# EAGLE design 06_ALU_IN (EAGLE 7.5.0)
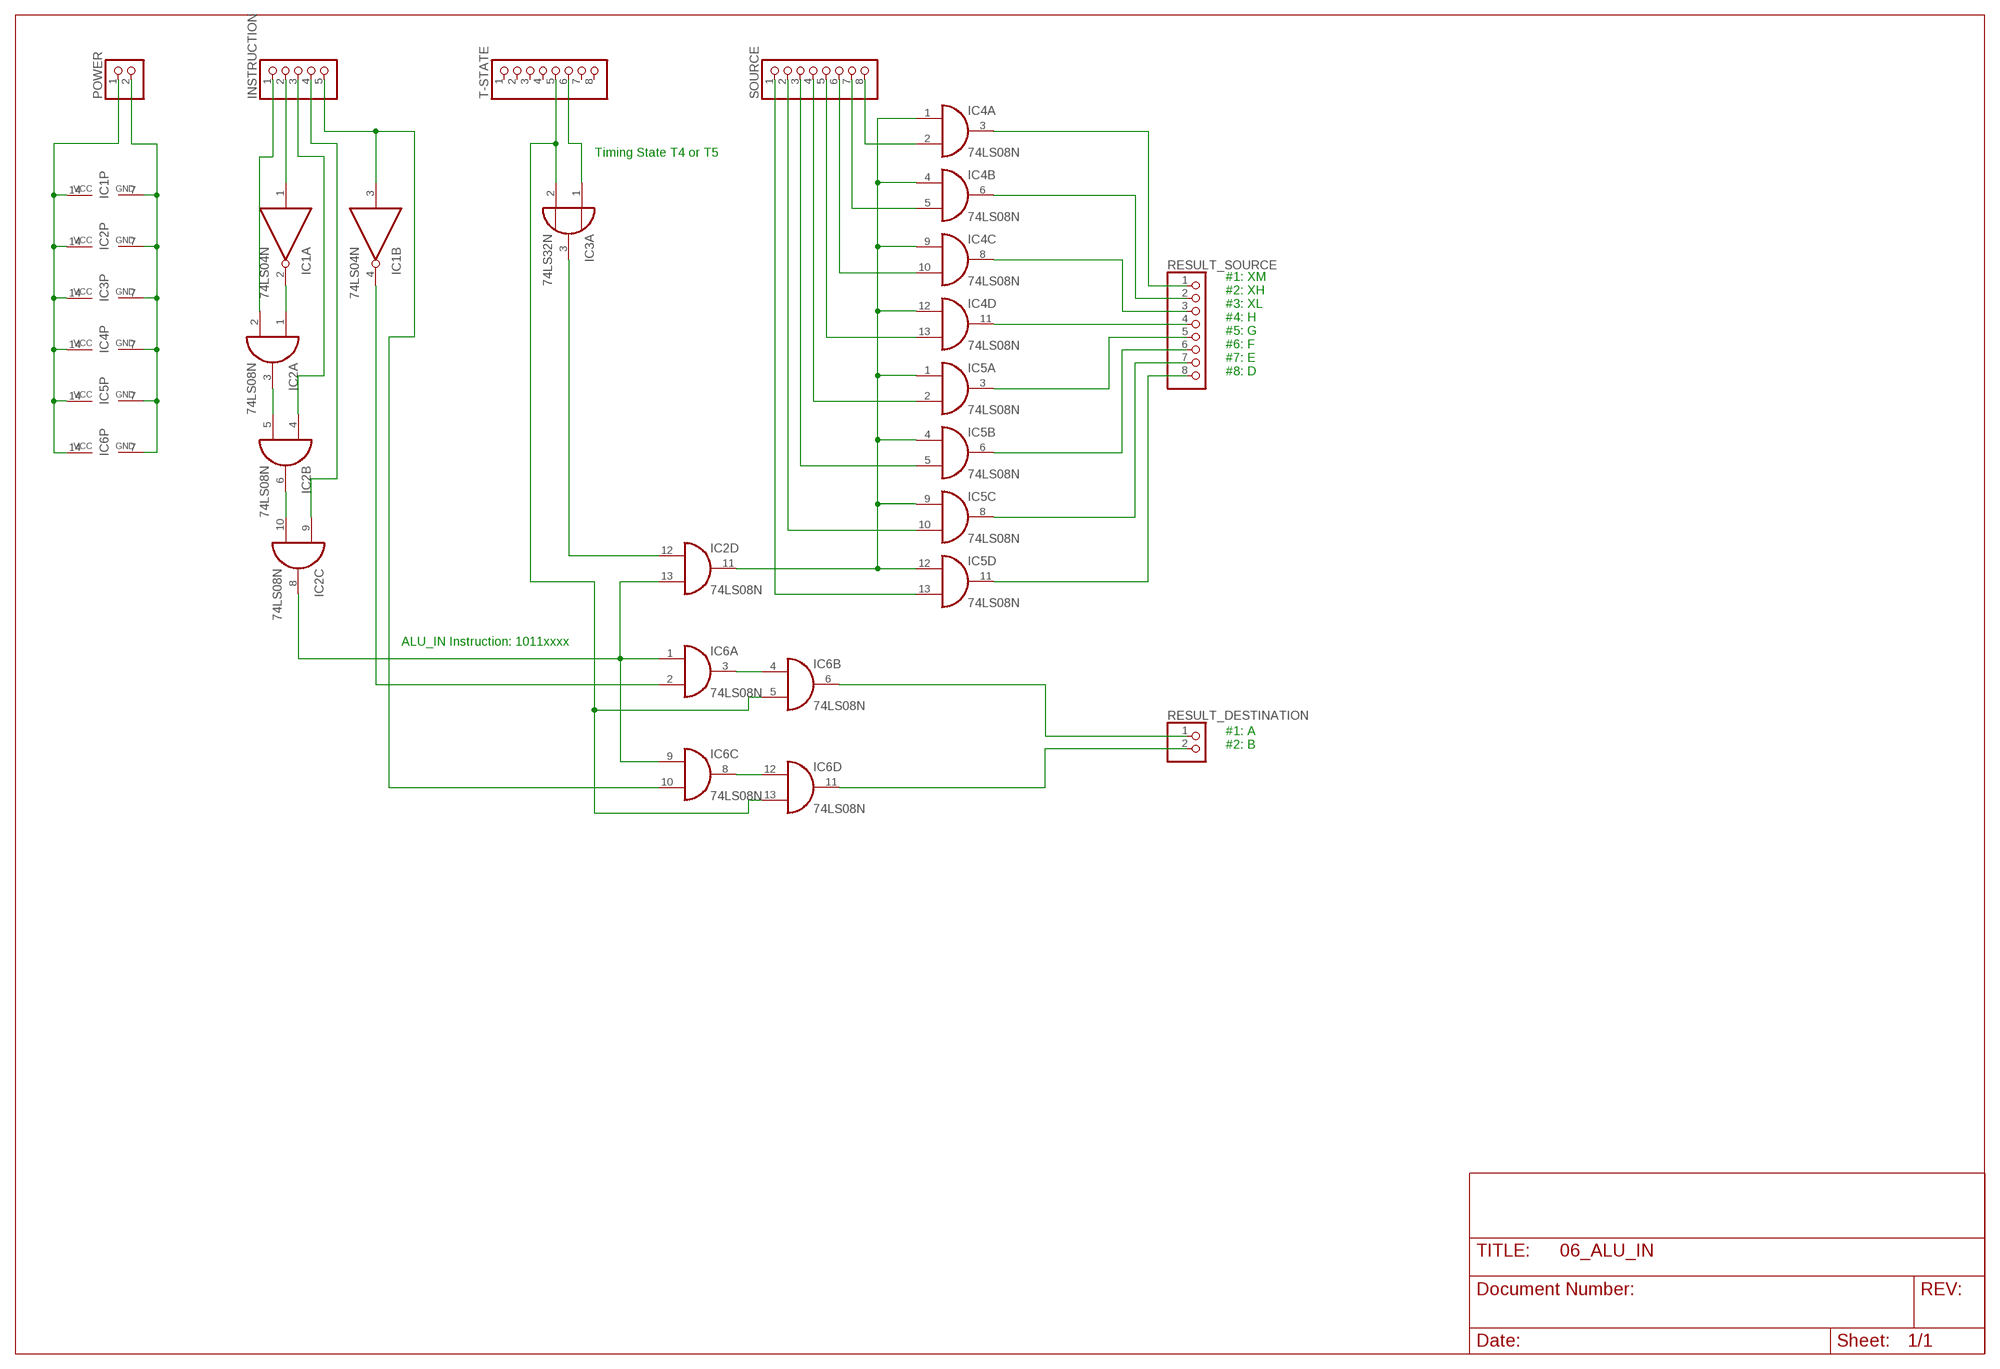
[diagram p0: schematic, sheet 1]

## Parts
IC1  74LS04N  [DIL14]
IC2  74LS08N  [DIL14]
IC3  74LS32N  [DIL14]
IC4  74LS08N  [DIL14]
IC5  74LS08N  [DIL14]
IC6  74LS08N  [DIL14]
INSTRUCTION  PINHD-1X5  [1X05]
POWER  PINHD-1X2  [1X02]
RESULT_DESTINATION  PINHD-1X2  [1X02]
RESULT_SOURCE  PINHD-1X8  [1X08]
SOURCE  PINHD-1X8  [1X08]
T-STATE  PINHD-1X8  [1X08]

## Nets
GND: IC1.7(P:GND) IC2.7(P:GND) IC3.7(P:GND) IC4.7(P:GND) IC5.7(P:GND) IC6.7(P:GND) POWER.2
N$1: IC1.1(A:I) INSTRUCTION.2
N$2: IC2.2(A:I1) INSTRUCTION.1
N$3: IC4.3(A:O) RESULT_SOURCE.1
N$4: IC1.2(A:O) IC2.1(A:I0)
N$5: IC2.3(A:O) IC2.5(B:I1)
N$6: IC2.4(B:I0) INSTRUCTION.3
N$7: IC2.6(B:O) IC2.10(C:I1)
N$8: IC2.9(C:I0) INSTRUCTION.4
N$9: IC2.8(C:O) IC2.13(D:I1) IC6.1(A:I0) IC6.9(C:I0)
N$10: IC3.2(A:I1) IC6.5(B:I1) IC6.13(D:I1) T-STATE.5
N$11: IC3.1(A:I0) T-STATE.6
N$12: IC2.12(D:I0) IC3.3(A:O)
N$13: IC2.11(D:O) IC4.1(A:I0) IC4.4(B:I0) IC4.9(C:I0) IC4.12(D:I0) IC5.1(A:I0) IC5.4(B:I0) IC5.9(C:I0) IC5.12(D:I0)
N$14: IC5.13(D:I1) SOURCE.1
N$15: IC5.10(C:I1) SOURCE.2
N$16: IC5.5(B:I1) SOURCE.3
N$17: IC5.2(A:I1) SOURCE.4
N$18: IC4.13(D:I1) SOURCE.5
N$19: IC4.10(C:I1) SOURCE.6
N$20: IC4.5(B:I1) SOURCE.7
N$21: IC4.2(A:I1) SOURCE.8
N$22: IC4.6(B:O) RESULT_SOURCE.2
N$23: IC4.8(C:O) RESULT_SOURCE.3
N$24: IC4.11(D:O) RESULT_SOURCE.4
N$25: IC5.3(A:O) RESULT_SOURCE.5
N$26: IC5.6(B:O) RESULT_SOURCE.6
N$27: IC5.8(C:O) RESULT_SOURCE.7
N$28: IC5.11(D:O) RESULT_SOURCE.8
N$29: IC1.3(B:I) IC6.10(C:I1) INSTRUCTION.5
N$30: IC1.4(B:O) IC6.2(A:I1)
N$31: IC6.3(A:O) IC6.4(B:I0)
N$32: IC6.8(C:O) IC6.12(D:I0)
N$33: IC6.6(B:O) RESULT_DESTINATION.1
N$34: IC6.11(D:O) RESULT_DESTINATION.2
VCC: IC1.14(P:VCC) IC2.14(P:VCC) IC3.14(P:VCC) IC4.14(P:VCC) IC5.14(P:VCC) IC6.14(P:VCC) POWER.1
Unconnected: IC1.5(C:I) IC1.6(C:O) IC1.8(D:O) IC1.9(D:I) IC1.10(E:O) IC1.11(E:I) IC1.12(F:O) IC1.13(F:I) IC3.4(B:I0) IC3.5(B:I1) IC3.6(B:O) IC3.8(C:O) IC3.9(C:I0) IC3.10(C:I1) IC3.11(D:O) IC3.12(D:I0) IC3.13(D:I1) T-STATE.1 T-STATE.2 T-STATE.3 T-STATE.4 T-STATE.7 T-STATE.8

## Notes on the sheet
- Timing State T4 or T5
- #1: XM
  #2: XH
  #3: XL
  #4: H
  #5: G
  #6: F
  #7: E
  #8: D
- ALU_IN Instruction: 1011xxxx
- #1: A
  #2: B

## Library data of the parts
IC1 = 74xx-eu:74*04: Hex INVERTER
IC2 IC4-IC6 = 74xx-eu:74*08: Quad 2-input AND gate
IC3 = 74xx-eu:74*32: Quad 2-input OR gate
INSTRUCTION = pinhead:PINHD-1X5: PIN HEADER
POWER RESULT_DESTINATION = pinhead:PINHD-1X2: PIN HEADER
RESULT_SOURCE SOURCE T-STATE = pinhead:PINHD-1X8: PIN HEADER

## Board
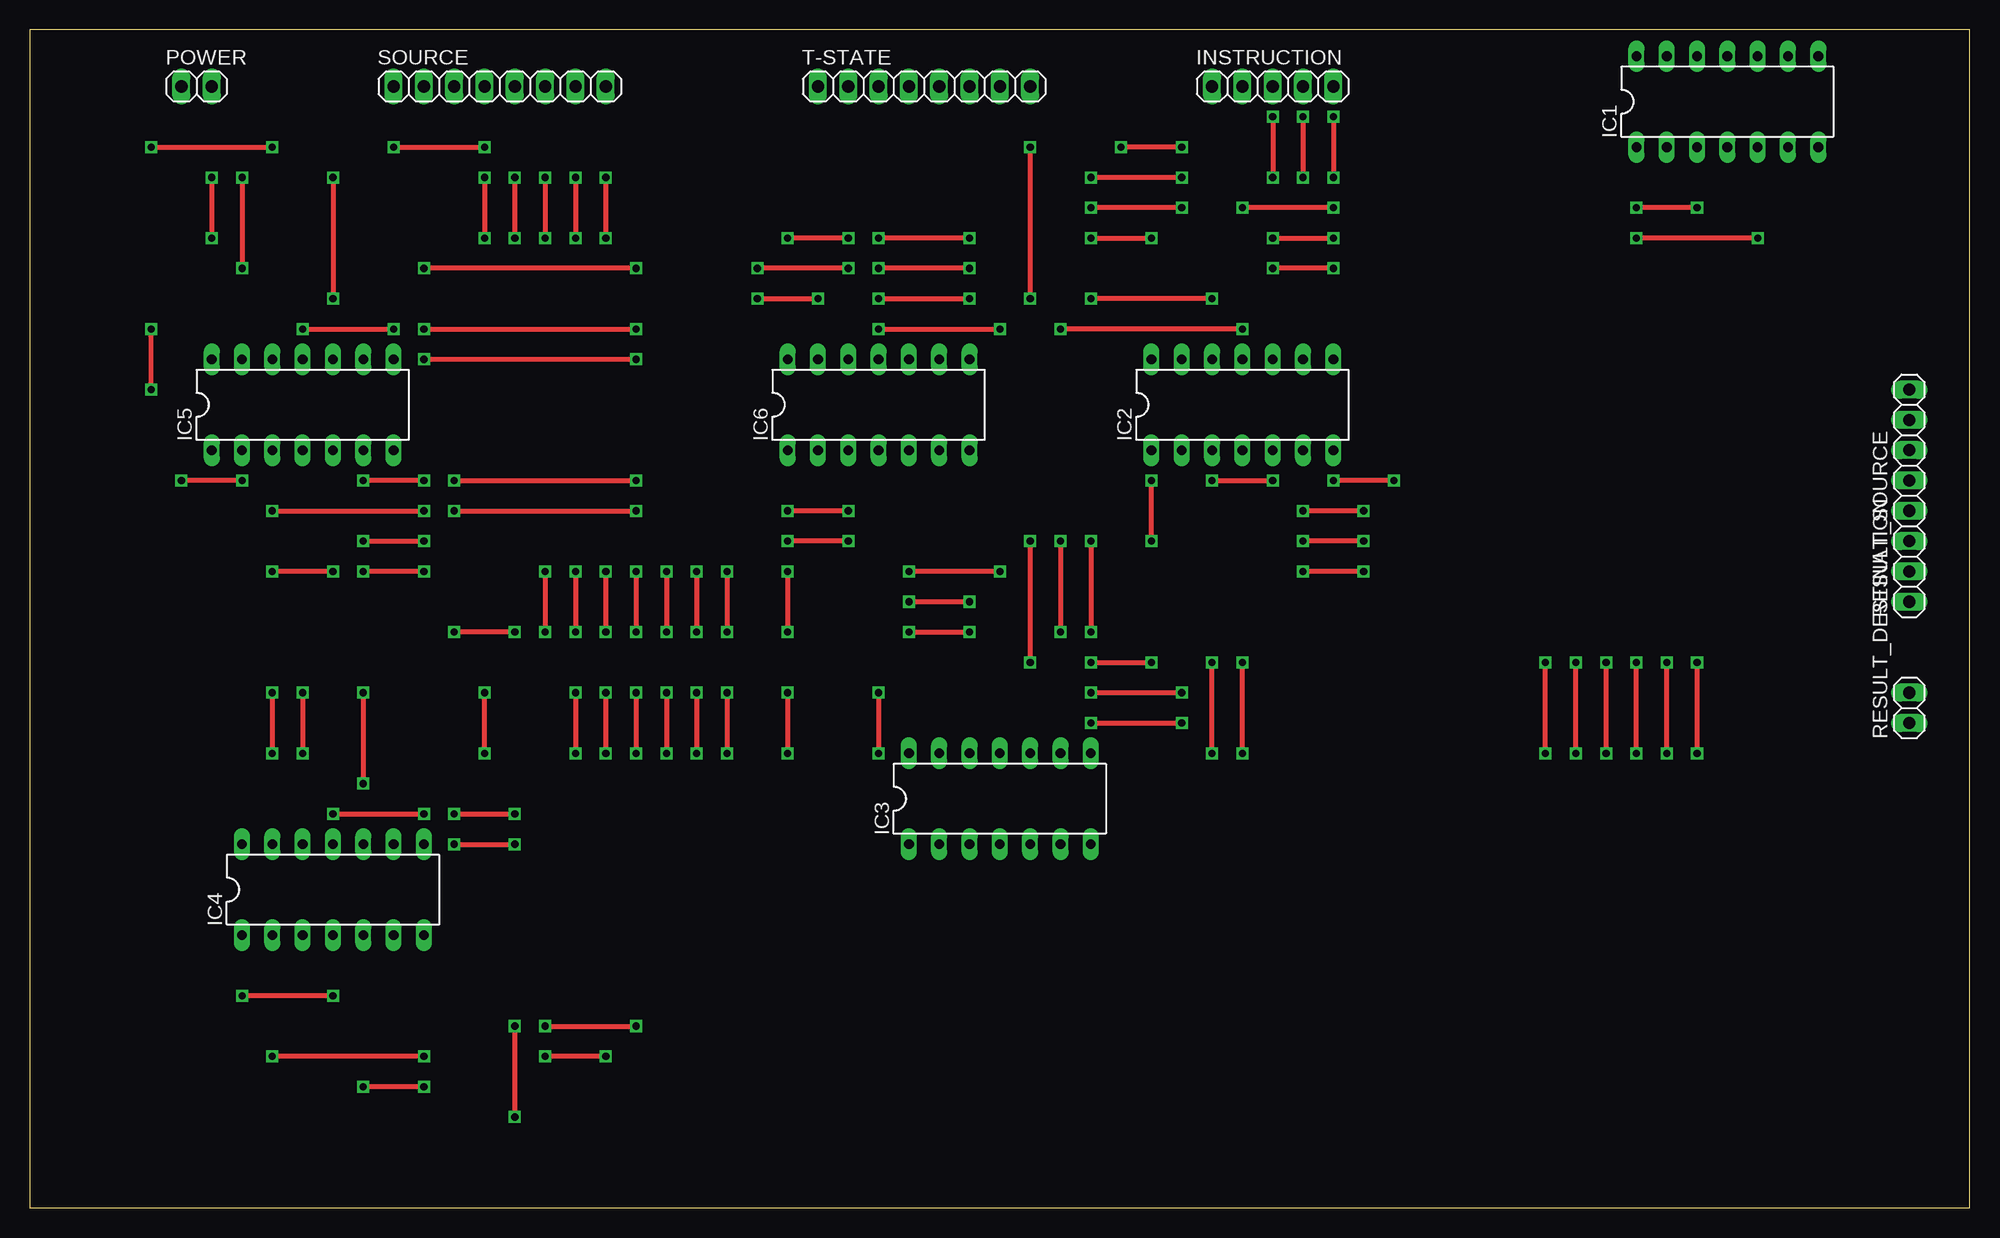
[diagram p1: board, top side]
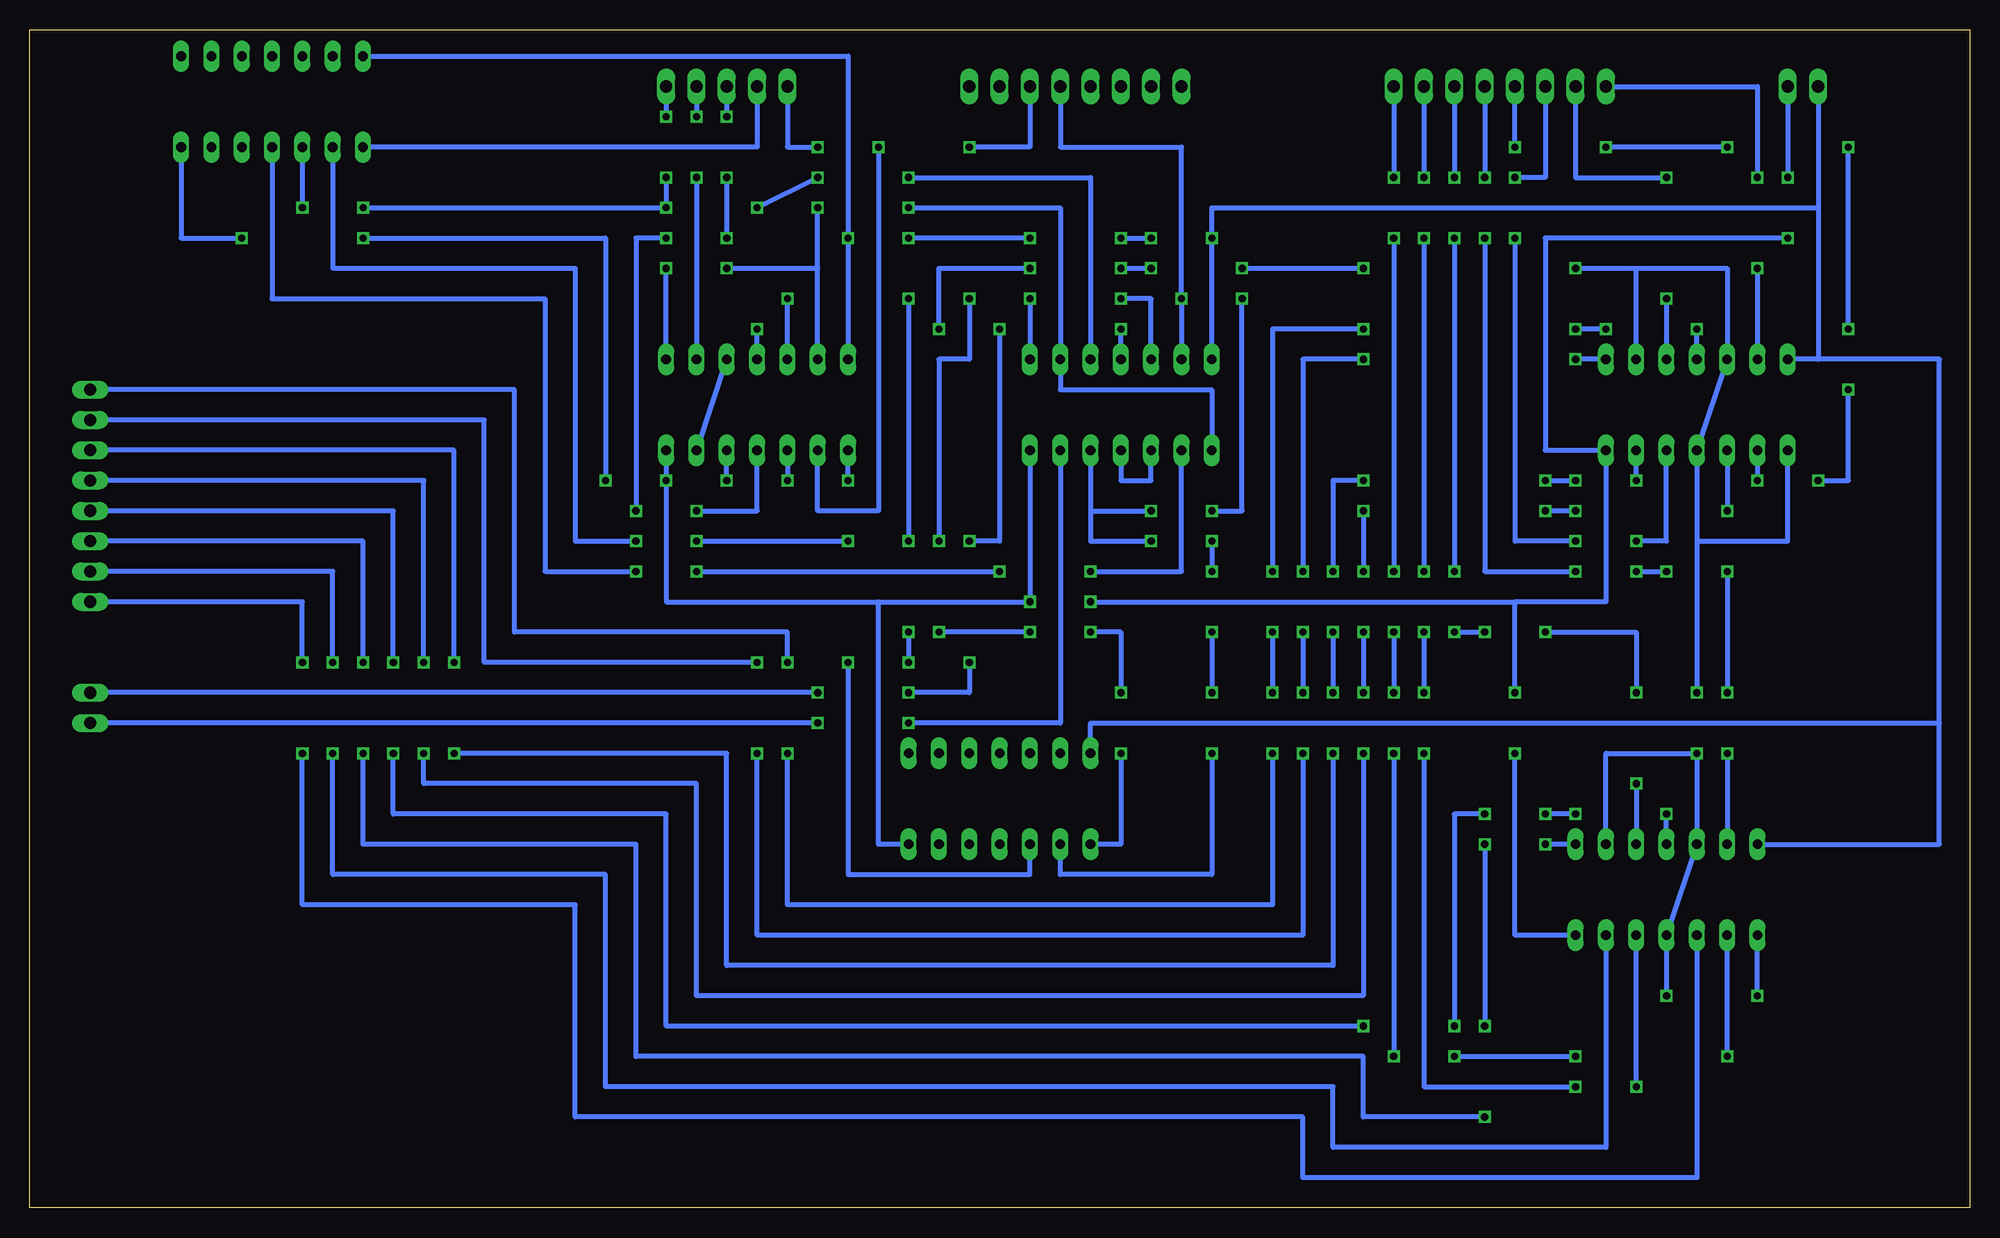
[diagram p2: board, bottom side, seen from below]

Size 162.54 x 98.73 mm. Coordinates in mm from the lower left corner, seen from the top.
Outline: 0,0 162.54,0 162.54,98.73 0,98.73 0,0
Copper layers (1*16): Top 0.035mm / dielectric 1.5mm / Bottom 0.035mm
Design rules "default": minimum track width 10mil, minimum drill 24mil, track to track 8mil, track to pad 8mil, pad to pad 8mil, via to via 8mil, smd to smd 8mil, copper to edge 40mil, drill to drill 8mil, minimum pad ring 10mil, minimum via ring 8mil, stop-mask expansion 4mil, vias tented up to drill 0mil, thermal gap 10mil

### Footprints (pad centres in the part's own frame; a part is rotated, then mirrored left to right if it is on the bottom)
DIL14 = drill 0.813 long: 1 -7.62,-3.81; 2 -5.08,-3.81; 3 -2.54,-3.81; 4 0,-3.81; 5 2.54,-3.81; 6 5.08,-3.81; 7 7.62,-3.81; 8 7.62,3.81; 9 5.08,3.81; 10 2.54,3.81; 11 0,3.81; 12 -2.54,3.81; 13 -5.08,3.81; 14 -7.62,3.81
1X05 = drill 1.016 long: 1 -5.08,0; 2 -2.54,0; 3 0,0; 4 2.54,0; 5 5.08,0
1X02 = drill 1.016 long: 1 -1.27,0; 2 1.27,0
1X08 = drill 1.016 long: 1 -8.89,0; 2 -6.35,0; 3 -3.81,0; 4 -1.27,0; 5 1.27,0; 6 3.81,0; 7 6.35,0; 8 8.89,0

### Placement (x,y rotation side)
IC1  142.24,92.71 0 top
IC2  101.6,67.31 0 top
IC3  81.28,34.29 0 top
IC4  25.4,26.67 0 top
IC5  22.86,67.31 0 top
IC6  71.12,67.31 0 top
INSTRUCTION  104.14,93.98 0 top
POWER  13.97,93.98 0 top
RESULT_DESTINATION  157.48,41.91 90 top
RESULT_SOURCE  157.48,59.69 90 top
SOURCE  39.37,93.98 0 top
T-STATE  74.93,93.98 0 top

### Tracks (layer width: path | path; a pad name or v marks a point on that pad's centre or on a via)
GND  (via drill 0.6)
  Top 0.406: v15.24,86.36 v15.24,81.28 | v38.1,38.1 v38.1,43.18 | v114.3,60.96 v109.22,60.96 | v78.74,50.8 v73.66,50.8 | v144.78,81.28 v134.62,81.28
  Bottom 0.406: POWER.2 v15.24,86.36 | v15.24,81.28 35.56,81.28 35.56,63.5 IC5.7 30.48,50.8 38.1,50.8 | IC2.7 v109.22,60.96 109.22,50.8 91.44,50.8 | 91.44,50.8 v78.74,50.8 IC6.7 | IC3.7 91.44,30.48 91.44,50.8 | IC4.7 38.1,22.86 v38.1,38.1 | v38.1,43.18 38.1,50.8 | v73.66,50.8 38.1,50.8 | IC1.7 149.86,81.28 v144.78,81.28 | v134.62,81.28 114.3,81.28 v114.3,60.96
N$1
  Bottom 0.406: INSTRUCTION.2 101.6,88.9 IC1.1
N$2  (via drill 0.6)
  Top 0.406: v96.52,88.9 v91.44,88.9
  Bottom 0.406: INSTRUCTION.1 99.06,88.9 v96.52,88.9 | v91.44,88.9 91.44,58.42 96.52,58.42 IC2.2
N$3  (via drill 0.6)
  Top 0.406: v139.7,38.1 v139.7,45.72
  Bottom 0.406: IC4.3 22.86,2.54 55.88,2.54 55.88,7.62 116.84,7.62 116.84,25.4 139.7,25.4 v139.7,38.1 | v139.7,45.72 139.7,50.8 RESULT_SOURCE.1
N$4  (via drill 0.6)
  Top 0.406: v111.76,55.88 v106.68,55.88 | v93.98,55.88 v93.98,60.96
  Bottom 0.406: IC1.2 137.16,78.74 116.84,78.74 116.84,55.88 v111.76,55.88 | v106.68,55.88 v93.98,55.88 | v93.98,60.96 IC2.1
N$5  (via drill 0.6)
  Top 0.406: v99.06,60.96 v104.14,60.96
  Bottom 0.406: IC2.3 v99.06,60.96 | v104.14,60.96 IC2.5
N$6  (via drill 0.6)
  Top 0.406: v104.14,91.44 v104.14,86.36 | v104.14,81.28 v109.22,81.28 | v111.76,58.42 v106.68,58.42
  Bottom 0.406: INSTRUCTION.3 v104.14,91.44 | v104.14,86.36 v104.14,81.28 | v109.22,81.28 111.76,81.28 v111.76,58.42 | v106.68,58.42 101.6,58.42 IC2.4
N$7
  Bottom 0.406: IC2.10 IC2.6
N$8  (via drill 0.6)
  Top 0.406: v106.68,91.44 v106.68,86.36
  Bottom 0.406: INSTRUCTION.4 v106.68,91.44 | v106.68,86.36 IC2.9
N$9  (via drill 0.6)
  Top 0.406: v96.52,83.82 v88.9,83.82 | v109.22,78.74 v104.14,78.74
  Bottom 0.406: IC2.13 96.52,78.74 | 96.52,78.74 v96.52,83.82 | v88.9,83.82 76.2,83.82 IC6.9 76.2,68.58 63.5,68.58 IC6.1 | IC2.8 v109.22,78.74 | v104.14,78.74 96.52,78.74
N$10  (via drill 0.6)
  Top 0.406: v68.58,58.42 v63.5,58.42 | v60.96,76.2 v66.04,76.2 | v68.58,55.88 v63.5,55.88 | v63.5,53.34 v63.5,48.26 | v63.5,43.18 v63.5,38.1
  Bottom 0.406: T-STATE.5 76.2,88.9 66.04,88.9 v66.04,76.2 IC6.13 | IC6.5 73.66,58.42 | 73.66,58.42 v68.58,58.42 | v63.5,58.42 60.96,58.42 v60.96,76.2 | 73.66,58.42 73.66,55.88 v68.58,55.88 | v63.5,55.88 v63.5,53.34 | v63.5,48.26 v63.5,43.18 | v63.5,38.1 63.5,27.94 76.2,27.94 IC3.2
N$11  (via drill 0.6)
  Top 0.406: v83.82,88.9 v83.82,76.2 | v86.36,55.88 v86.36,48.26 | v71.12,43.18 v71.12,38.1 | v73.66,48.26 v78.74,48.26
  Bottom 0.406: T-STATE.6 78.74,88.9 v83.82,88.9 | v71.12,43.18 71.12,48.26 v73.66,48.26 | v71.12,38.1 71.12,30.48 IC3.1 | v83.82,76.2 83.82,71.12 86.36,71.12 v86.36,55.88 | v78.74,48.26 v86.36,48.26
N$12  (via drill 0.6)
  Top 0.406: v99.06,76.2 v88.9,76.2 | v88.9,55.88 v88.9,48.26 | v88.9,45.72 v93.98,45.72
  Bottom 0.406: IC2.12 v99.06,76.2 | v88.9,76.2 v88.9,55.88 | v88.9,48.26 v88.9,45.72 | v93.98,45.72 93.98,27.94 78.74,27.94 IC3.3
N$13  (via drill 0.6)
  Top 0.406: v101.6,73.66 v86.36,73.66 | v78.74,78.74 v71.12,78.74 | v68.58,78.74 v60.96,78.74 | v50.8,78.74 v33.02,78.74 | v22.86,43.18 v22.86,38.1 | v25.4,17.78 v17.78,17.78
  Bottom 0.406: IC2.11 v101.6,73.66 | v86.36,73.66 86.36,78.74 v78.74,78.74 | v71.12,78.74 v68.58,78.74 | v60.96,78.74 v50.8,78.74 | v33.02,78.74 27.94,78.74 | 27.94,78.74 20.32,78.74 IC5.12 IC5.4 22.86,55.88 | 22.86,55.88 15.24,55.88 IC5.1 | IC5.9 27.94,78.74 | 22.86,55.88 v22.86,43.18 | IC4.9 30.48,38.1 v22.86,38.1 IC4.12 IC4.4 v25.4,17.78 | v17.78,17.78 IC4.1
N$14  (via drill 0.6)
  Top 0.406: v17.78,86.36 v17.78,78.74
  Bottom 0.406: SOURCE.1 17.78,93.98 v17.78,86.36 | v17.78,78.74 IC5.13
N$15  (via drill 0.6)
  Top 0.406: v25.4,86.36 v25.4,76.2
  Bottom 0.406: SOURCE.2 33.02,86.36 v25.4,86.36 | v25.4,76.2 IC5.10
N$16  (via drill 0.6)
  Top 0.406: v38.1,86.36 v38.1,81.28 | v27.94,55.88 v33.02,55.88
  Bottom 0.406: IC5.5 25.4,55.88 v27.94,55.88 | SOURCE.3 35.56,86.36 v38.1,86.36 | v38.1,81.28 38.1,55.88 v33.02,55.88
N$17  (via drill 0.6)
  Top 0.406: v17.78,60.96 v12.7,60.96 | v10.16,68.58 v10.16,73.66 | v10.16,88.9 v20.32,88.9 | v30.48,88.9 v38.1,88.9
  Bottom 0.406: IC5.2 v17.78,60.96 | v12.7,60.96 10.16,60.96 v10.16,68.58 | v10.16,73.66 v10.16,88.9 | v20.32,88.9 v30.48,88.9 | v38.1,88.9 SOURCE.4
N$18  (via drill 0.6)
  Top 0.406: v25.4,53.34 v20.32,53.34 | v20.32,43.18 v20.32,38.1 | v40.64,86.36 v40.64,81.28 | v33.02,53.34 v27.94,53.34
  Bottom 0.406: v20.32,53.34 v20.32,43.18 | v20.32,38.1 IC4.13 | SOURCE.5 v40.64,86.36 | v40.64,81.28 40.64,53.34 v33.02,53.34 | v27.94,53.34 v25.4,53.34
N$19  (via drill 0.6)
  Top 0.406: v43.18,86.36 v43.18,81.28 | v43.18,53.34 v43.18,48.26 | v40.64,48.26 v35.56,48.26 | v27.94,43.18 v27.94,35.56
  Bottom 0.406: SOURCE.6 v43.18,86.36 | v43.18,81.28 v43.18,53.34 | v43.18,48.26 v40.64,48.26 | v35.56,48.26 27.94,48.26 v27.94,43.18 | v27.94,35.56 IC4.10
N$20  (via drill 0.6)
  Top 0.406: v45.72,86.36 v45.72,81.28 | v45.72,53.34 v45.72,48.26 | v45.72,43.18 v45.72,38.1 | v33.02,10.16 v27.94,10.16
  Bottom 0.406: SOURCE.7 v45.72,86.36 | v45.72,81.28 v45.72,53.34 | v45.72,48.26 v45.72,43.18 | v45.72,38.1 45.72,10.16 v33.02,10.16 | IC4.5 27.94,15.24 v27.94,10.16
N$21  (via drill 0.6)
  Top 0.406: v48.26,86.36 v48.26,81.28 | v48.26,53.34 v48.26,48.26 | v48.26,43.18 v48.26,38.1 | v48.26,12.7 v43.18,12.7 | v33.02,12.7 v20.32,12.7
  Bottom 0.406: SOURCE.8 v48.26,86.36 | v48.26,81.28 v48.26,53.34 | v48.26,48.26 v48.26,43.18 | v48.26,38.1 v48.26,12.7 | v43.18,12.7 v33.02,12.7 | v20.32,12.7 IC4.2
N$22  (via drill 0.6)
  Top 0.406: v137.16,38.1 v137.16,45.72
  Bottom 0.406: IC4.6 30.48,5.08 53.34,5.08 53.34,10.16 114.3,10.16 114.3,27.94 137.16,27.94 v137.16,38.1 | v137.16,45.72 137.16,53.34 RESULT_SOURCE.2
N$23  (via drill 0.6)
  Top 0.406: v35.56,30.48 v40.64,30.48 | v40.64,15.24 v40.64,7.62 | v134.62,38.1 v134.62,45.72
  Bottom 0.406: IC4.8 v35.56,30.48 | v40.64,30.48 v40.64,15.24 | v40.64,7.62 50.8,7.62 50.8,12.7 111.76,12.7 111.76,30.48 134.62,30.48 v134.62,38.1 | v134.62,45.72 134.62,55.88 RESULT_SOURCE.3
N$24  (via drill 0.6)
  Top 0.406: v43.18,15.24 v50.8,15.24 | v132.08,38.1 v132.08,45.72 | v25.4,33.02 v33.02,33.02 | v35.56,33.02 v40.64,33.02
  Bottom 0.406: IC4.11 v25.4,33.02 | v40.64,33.02 43.18,33.02 v43.18,15.24 | v50.8,15.24 109.22,15.24 109.22,33.02 132.08,33.02 v132.08,38.1 | v132.08,45.72 132.08,58.42 RESULT_SOURCE.4 | v33.02,33.02 v35.56,33.02
N$25  (via drill 0.6)
  Top 0.406: v20.32,58.42 v33.02,58.42 | v35.56,58.42 v50.8,58.42 | v50.8,53.34 v50.8,48.26 | v50.8,43.18 v50.8,38.1 | v129.54,38.1 v129.54,45.72
  Bottom 0.406: IC5.3 v20.32,58.42 | v33.02,58.42 v35.56,58.42 | v50.8,58.42 v50.8,53.34 | v50.8,48.26 v50.8,43.18 | v50.8,38.1 50.8,17.78 106.68,17.78 106.68,35.56 129.54,35.56 v129.54,38.1 | v129.54,45.72 129.54,60.96 RESULT_SOURCE.5
N$26  (via drill 0.6)
  Top 0.406: v35.56,60.96 v50.8,60.96 | v53.34,53.34 v53.34,48.26 | v53.34,43.18 v53.34,38.1 | v127,38.1 v127,45.72 | v33.02,60.96 v27.94,60.96
  Bottom 0.406: v50.8,60.96 53.34,60.96 v53.34,53.34 | v53.34,48.26 v53.34,43.18 | v53.34,38.1 53.34,20.32 104.14,20.32 104.14,38.1 v127,38.1 | v127,45.72 127,63.5 RESULT_SOURCE.6 | v35.56,60.96 v33.02,60.96 | v27.94,60.96 IC5.6
N$27  (via drill 0.6)
  Top 0.406: v33.02,71.12 v50.8,71.12 | v55.88,53.34 v55.88,48.26 | v55.88,43.18 v55.88,38.1 | v101.6,38.1 v101.6,45.72
  Bottom 0.406: IC5.8 v33.02,71.12 | v50.8,71.12 55.88,71.12 v55.88,53.34 | v55.88,48.26 v55.88,43.18 | v55.88,38.1 55.88,22.86 101.6,22.86 v101.6,38.1 | v101.6,45.72 124.46,45.72 124.46,66.04 RESULT_SOURCE.7
N$28  (via drill 0.6)
  Top 0.406: v22.86,73.66 v30.48,73.66 | v33.02,73.66 v50.8,73.66 | v58.42,53.34 v58.42,48.26 | v58.42,43.18 v58.42,38.1 | v99.06,38.1 v99.06,45.72
  Bottom 0.406: IC5.11 v22.86,73.66 | v30.48,73.66 v33.02,73.66 | v50.8,73.66 58.42,73.66 v58.42,53.34 | v58.42,48.26 v58.42,43.18 | v58.42,38.1 58.42,25.4 99.06,25.4 v99.06,38.1 | v99.06,45.72 99.06,48.26 121.92,48.26 121.92,68.58 RESULT_SOURCE.8
N$29  (via drill 0.6)
  Top 0.406: v109.22,91.44 v109.22,86.36 | v109.22,83.82 v101.6,83.82 | v96.52,86.36 v88.9,86.36 | v139.7,83.82 v134.62,83.82
  Bottom 0.406: INSTRUCTION.5 v109.22,91.44 | v109.22,86.36 v109.22,83.82 v134.62,83.82 | v101.6,83.82 v96.52,86.36 | v88.9,86.36 73.66,86.36 IC6.10 | IC1.3 v139.7,83.82
N$30  (via drill 0.6)
  Top 0.406: v111.76,53.34 v106.68,53.34 | v81.28,53.34 v73.66,53.34
  Bottom 0.406: IC1.4 142.24,76.2 119.38,76.2 119.38,53.34 v111.76,53.34 | v106.68,53.34 v81.28,53.34 | v73.66,53.34 66.04,53.34 IC6.2
N$31
  Bottom 0.406: IC6.4 71.12,60.96 68.58,60.96 IC6.3
N$32  (via drill 0.6)
  Top 0.406: v71.12,76.2 v78.74,76.2
  Bottom 0.406: IC6.12 68.58,76.2 v71.12,76.2 | v78.74,76.2 IC6.8
N$33  (via drill 0.6)
  Top 0.406: v88.9,40.64 v96.52,40.64
  Bottom 0.406: IC6.6 76.2,40.64 v88.9,40.64 | v96.52,40.64 RESULT_DESTINATION.1
N$34  (via drill 0.6)
  Top 0.406: v71.12,73.66 v81.28,73.66 | v83.82,55.88 v83.82,45.72 | v88.9,43.18 v96.52,43.18
  Bottom 0.406: IC6.11 v71.12,73.66 | v81.28,73.66 81.28,55.88 v83.82,55.88 | v83.82,45.72 83.82,43.18 v88.9,43.18 | v96.52,43.18 RESULT_DESTINATION.2
VCC  (via drill 0.6)
  Top 0.406: v78.74,81.28 v71.12,81.28 | v88.9,81.28 v93.98,81.28 | v68.58,81.28 v63.5,81.28
  Bottom 0.406: POWER.1 12.7,83.82 | 12.7,83.82 12.7,71.12 | 12.7,71.12 IC5.14 | IC6.14 v63.5,81.28 63.5,83.82 12.7,83.82 | IC1.14 93.98,96.52 v93.98,81.28 IC2.14 | IC4.14 2.54,30.48 2.54,40.64 | 2.54,40.64 2.54,71.12 12.7,71.12 | IC3.14 73.66,40.64 2.54,40.64 | v78.74,81.28 v88.9,81.28 | v71.12,81.28 v68.58,81.28